# Altium schematic sheet ECU_AutoRC_PWR_SUPPLY_6A_r00.SchDoc
size A4; SheetNumber: 8; SheetTotal: 8
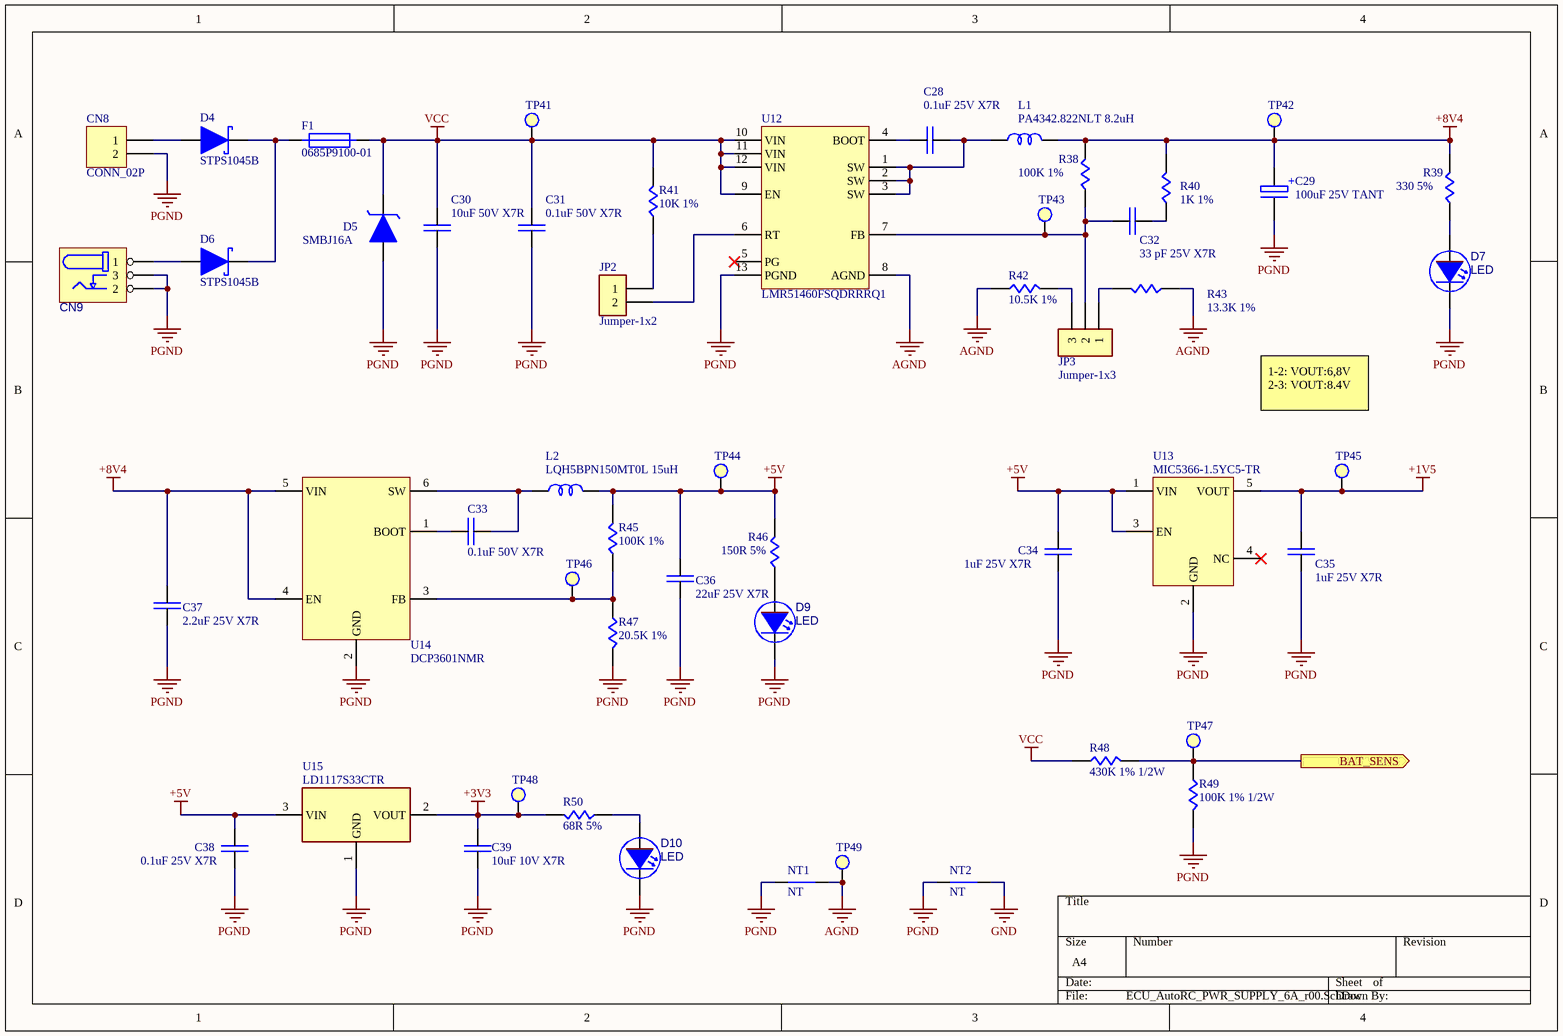
[diagram p0: ECU_AutoRC_PWR_SUPPLY_6A_r00.SchDoc]

## Parts
C28  0.1uF 25V X7R  [C_0805]
C29  100uF 25V TANT  [C_TANT_2917]
C30  10uF 50V X7R  [C_1206]
C31  0.1uF 50V X7R  [C_0805]
C32  33 pF 25V X7R  [C_0805]
C33  0.1uF 50V X7R  [C_0805]
C34  1uF 25V X7R  [C_0805]
C35  1uF 25V X7R  [C_0805]
C36  22uF 25V X7R  [C_0805]
C37  2.2uF 25V X7R  [C_0805]
C38  0.1uF 25V X7R  [C_0805]
C39  10uF 10V X7R  [C_0805]
CN8  CONN_02P  [CONN_BAT]
CN9  CN_PowerJack  [PJ002B]  (value not drawn)
D4  STPS1045B  [TO252_1]
D5  SMBJ16A  [D_SMB]
D6  STPS1045B  [TO252_1]
D7  LED  [LED_0805]
D9  LED  [LED_0805]
D10  LED  [LED_0805]
F1  0685P9100-01  [F_1206]
JP2  Jumper-1x2  [Header_M_1x2_0.1"]
JP3  Jumper-1x3  [Header_M_1x3_0.1"]
L1  PA4342.822NLT 8.2uH  [IND_PA4342.822NLT]
L2  LQH5BPN150MT0L 15uH  [IND_LQH5BPN150MT0L]
NT1  NT  [NET_TIE]
NT2  NT  [NET_TIE]
R38  100K 1%  [R_0805]
R39  330 5%  [R_0805]
R40  1K 1%  [R_0805]
R41  10K 1%  [R_0805]
R42  10.5K 1%  [R_0805]
R43  13.3K 1%  [R_0805]
R45  100K 1%  [R_0805]
R46  150R 5%  [R_0805]
R47  20.5K 1%  [R_0805]
R48  430K 1% 1/2W  [R_1210]
R49  100K 1% 1/2W  [R_1210]
R50  68R 5%  [R_0805]
TP41  Test Point  [TEST_POINT]  (value not drawn)
TP42  Test Point  [TEST_POINT]  (value not drawn)
TP43  Test Point  [TEST_POINT]  (value not drawn)
TP44  Test Point  [TEST_POINT]  (value not drawn)
TP45  Test Point  [TEST_POINT]  (value not drawn)
TP46  Test Point  [TEST_POINT]  (value not drawn)
TP47  Test Point  [TEST_POINT]  (value not drawn)
TP48  Test Point  [TEST_POINT]  (value not drawn)
TP49  Test Point  [TEST_POINT]  (value not drawn)
U12  LMR51460FSQDRRRQ1  [LMR51460FSQDRRRQ1]
U13  MIC5366-1.5YC5-TR  [SC 70-5]
U14  DCP3601NMR  [SOT23-6]
U15  LD1117S33CTR  [SOT-223]

## Ports
BAT_SENS (out, see ECU_AutoRC_BLK_r00[2B], ECU_AutoRC_UC1_r00[4A])

## Nets
+1V5: C35.1 TP45.1 U13.5(VOUT)
+3V3: C39.1 R50.2 TP48.1 U15.2(VOUT)
+5V: C34.1 C36.1 C38.1 L2.2 R45.2 R46.2 TP44.1 U13.1(VIN) U13.3(EN) U15.3(VIN)
+8V4: C29.1 C37.1 L1.2 R38.2 R39.2 R40.2 TP42.1 U14.4(EN) U14.5(VIN)
AGND: NT1.2 R42.1 R43.1 TP49.1 U12.8(AGND)
GND: NT2.2
PGND: C29.2 C30.1 C31.1 C34.2 C35.2 C36.2 C37.2 C38.2 C39.2 CN8.2 CN9.2 CN9.3 D5.1(Anode) D7.2(K) D9.2(K) D10.2(K) NT1.1 NT2.1 R47.2 R49.2 U12.13(PGND) U13.2(GND) U14.2(GND) U15.1(GND)
VCC: C30.2 C31.2 D5.2(Catode) F1.2 R41.2 R48.1 TP41.1 U12.9(EN) U12.10(VIN) U12.11(VIN) U12.12(VIN)
BAT_SENS: R48.2 R49.1 TP47.1 ; port BAT_SENS
NetC28_1: C28.1 U12.4(BOOT)
NetC28_2: C28.2 L1.1 U12.1(SW) U12.2(SW) U12.3(SW)
NetC32_1: C32.1 JP3.2 R38.1 TP43.1 U12.7(FB)
NetC32_2: C32.2 R40.1
NetC33_1: C33.1 U14.1(BOOT)
NetC33_2: C33.2 L2.1 U14.6(SW)
NetCN8_1: CN8.1 D4.1(Anode)
NetCN9_1: CN9.1 D6.1(Anode)
NetD4_2: D4.2(Catode) D6.2(Catode) F1.1
NetD7_1: D7.1(A) R39.1
NetD9_1: D9.1(A) R46.1
NetD10_1: D10.1(A) R50.1
NetJP2_1: JP2.1 R41.1
NetJP2_2: JP2.2 U12.6(RT)
NetJP3_1: JP3.1 R43.2
NetJP3_3: JP3.3 R42.2
NetR45_1: R45.1 R47.1 TP46.1 U14.3(FB)

Not connected (* = marked no-connect by the designer): U12 5(PG)*; U13 4(NC)*

## Notes on the sheet
- 1-2: VOUT:6,8V
  2-3: VOUT:8.4V
- (in symbol Capacitor Polarizado) +

## Library data of the parts
C28 C30-C39 = Capacitor NP: Non Polarizated Capacitor
C29 = Capacitor Polarizado: Polarizated Capacitor
CN8 = CONN_02P: 2 Pin Connector
CN9 = CN_PowerJack: Barrel Power Connector
D4 D6 = Diode_Schottky: Diode Schottky
D5 = Diode_Zener: Diode Zener
F1 = FUSE: Fuse | Quick Acting; MF: Bel Fuse; MP: 0679L1000-05; SnapEDA_Link: https://www.snapeda.com/parts/0679L1000-05/Bel+Fuse/view-part/?ref=snap; Package: SMD-2; Price: None; Availability: Unavailable; Check_prices: https://www.snapeda.com/parts/0679L1000-05/Bel+Fuse/view-part/?ref=eda; Value: *
L1 L2 = Inductor
NT1 NT2 = NET_TIE_SMD
R38-R43 R45-R50 = Resistor
TP41-TP49 = TestPoint
U12 = LMR51460FSQDRRRQ1: IC REG BUCK ADJ 6A 12WSON
U13 = MIC5366-1.5YC5-TR: IC REG LINEAR 1.5V 150MA SC-70-5
U15 = LD1117S33CTR: IC REG LINEAR 3.3V 800MA SOT-223